# Altium schematic sheet suicide-switch-circuit-with-usb-battery-charger.SchDoc
size A4
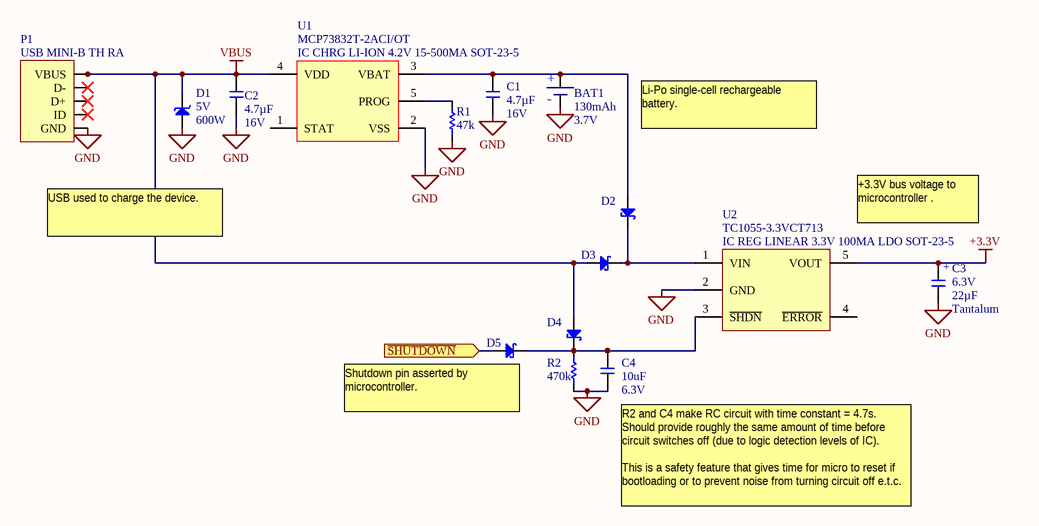
[diagram p0: suicide-switch-circuit-with-usb-battery-charger.SchDoc]

## Parts
BAT1  Capacity: 130mAh  Voltage: 3.7V  (hidden comment: BAT)
C1  Capacitance: 4.7µF  Voltage - Rated: 16V  [CAP-N-1608[0603]]  (hidden comment: EMK212BJ475KG-T)
C2  Capacitance: 4.7µF  Voltage - Rated: 16V  [CAP-N-1608[0603]]  (hidden comment: EMK212BJ475KG-T)
C3  Voltage - Rated: 6.3V  Capacitance: 22µF  Type: Tantalum  [CAP TAN 3216[1206]]  (hidden comment: TAJA226K006RNJ)
C4  Capacitance: 10uF  Voltage - Rated: 6.3V  [CAP-N-3216[1206]]  (hidden comment: GRM31CR60J107ME39L)
D1  Voltage - Reverse Standoff (Typ): 5V  Power (Watts): 600W  [SMA (DO-214AC)]  (hidden comment: SMA6J5.0A-TR)
D2  CDBU0130L  [DIODE-N-1608[0603]]  (value not drawn)
D3  CDBU0130L  [DIODE-N-1608[0603]]  (value not drawn)
D4  CDBU0130L  [DIODE-N-1608[0603]]  (value not drawn)
D5  CDBU0130L  [DIODE-N-1608[0603]]  (value not drawn)
P1  USB MINI-B TH RA  [USB MINI-B TH RA]
R1  Resistance (Ohms): 47k  [RES-N-1608[0603]]  (hidden comment: RC0603FR-0747KL)
R2  Resistance (Ohms): 470k  [RES-N-1608[0603]]  (hidden comment: RC0603FR-0747KL)
U1  (no value)  [SOT-23-5]
U2  TC1055-3.3VCT713  [SOT-23-5]

## Ports
~{SHUTDOWN} (in)

## Nets
+3.3V: C3.1 U2.5(VOUT)
GND: BAT1.2(-) C1.1 C2.1 C3.2 C4.1 D1.1(A) P1.5(GND) R1.1 R2.1 U1.2(VSS) U2.2(GND)
VBUS: C2.2 D1.2(K) D3.1(A) D4.1(A) P1.1(VBUS) U1.4(VDD)
~{SHUTDOWN}: D5.1(A) ; port ~{SHUTDOWN}
NetBAT1_1: BAT1.1(+) C1.2 D2.1(A) U1.3(VBAT)
NetC4_2: C4.2 D4.2(K) D5.2(K) R2.2 U2.3(~{SHDN})
NetD2_2: D2.2(K) D3.2(K) U2.1(VIN)
NetR1_2: R1.2 U1.5(PROG)

Not connected (* = marked no-connect by the designer): P1 2(D-)* 3(D+)* 4(ID)*; U1 1(STAT); U2 4(~{ERROR})

## Notes on the sheet
- Li-Po single-cell rechargeable battery.
- USB used to charge the device.
- +3.3V bus voltage to microcontroller .
- (near D5) Shutdown pin asserted by microcontroller.
- R2 and C4 make RC circuit with time constant = 4.7s. Should provide roughly the same amount of time before circuit switches off (due to logic detection levels of IC).
  This is a safety feature that gives time for micro to reset if bootloading or to prevent noise from turning circuit off e.t.c.
- (in symbol TAJA226K006RNJ) +

## Library data of the parts
BAT1 = BATT: BATT LI-PO 1CELL
C1 C2 = EMK212BJ475KG-T: CAP CER 0603 4.7uF 16V X5R 10%; Manufacturer: Taiyo Yuden; Description: CAP CER 4.7UF 16V 10% X5R 0805; Supplier 1: Digi-Key; Manufacturer Part Number: EMK212BJ475KG-T; RoHS: RoHS Compliant; Category: Capacitors; Stock 1: 69489; Pricing 1: 1=0.24, 10=0.165, 50=0.1, 100=0.084, 250=0.068, 500=0.06, 1000=0.051 (USD); Tolerance: ±10%; Temperature Coefficient: X5R; Mounting Type: Surface Mount, MLCC; Operating Temperature: -55°C ~ 85°C; Applications: General Purpose; Ratings: -; Package / Case: 0805 (2012 Metric); Size / Dimension: 0.079" L x 0.049" W (2.00mm x 1.25mm); Height - Seated (Max): -; Thickness (Max): 0.053" (1.35mm); Lead Spacing: -; Features: -; Packaging: Cut Tape (CT); Lead Style: -; ComponentLink1URL: http://www.yuden.co.jp/productdata/catalog/en/mlcc01_e.pdf; ComponentLink1Description: http://www.yuden.co.jp/productdata/catalog/en/mlcc01_e.pdf; Supplier Part Number 1: 587-1294-1-ND
C3 = TAJA226K006RNJ: CAP TAN 22UF 6.3V 10% 1206; Manufacturer: AVX Corporation; Manufacturer Size Code: A; Description: CAP TANT 22UF 6.3V 10% 1206; ESR (Equivalent Series Resistance): 3.000 Ohm; Type: Molded; Supplier 1: Digi-Key; Manufacturer Part Number: TAJA226K006RNJ; RoHS: RoHS Compliant; Category: Capacitors; Stock 1: 1618284; Pricing 1: 1=0.33, 10=0.287, 100=0.1435, 250=0.1148, 500=0.10456, 1000=0.0943 (USD); Tolerance: ±10%; Operating Temperature: -55°C ~ 125°C; Mounting Type: Surface Mount; Package / Case: 1206 (3216 Metric); Size / Dimension: 0.126" L x 0.063" W (3.20mm x 1.60mm); Height - Seated (Max): 0.071" (1.80mm); Lead Spacing: -; Features: General Purpose; Packaging: Cut Tape (CT); Lifetime @ Temp.: -; ComponentLink1URL: http://www.avx.com/docs/Catalogs/taj.pdf; ComponentLink1Description: http://www.avx.com/docs/Catalogs/taj.pdf; Supplier Part Number 1: 478-3865-1-ND
C4 = GRM31CR60J107ME39L: CAP CER 1206 100uF 6.3V X5R 20%
D1 = SMA6J5.0A-TR: DIODE TVS 5.0V UNI 600W SMA; Manufacturer: STMicroelectronics; Description: TRANSIL 600W 5.0V UNIDIRECT SMA; Voltage - Breakdown: 6.4V; Polarization: Unidirectional; Supplier 1: Digi-Key; RoHS: RoHS Compliant; Category: Circuit Protection; Stock 1: 45547; Pricing 1: 1=0.54, 10=0.453, 25=0.3972, 100=0.3399, 250=0.2948, 500=0.2497, 1000=0.1925, 2500=0.176 (USD); Mounting Type: Surface Mount; Package / Case: DO-214AC, SMA; Supplier Device Package: SMA; Packaging: Cut Tape (CT); ComponentLink1URL: http://www.st.com/internet/com/TECHNICAL_RESOURCES/TECHNICAL_LITERATURE/DATASHEET/CD00152688.pdf; ComponentLink1Description: http://www.st.com/internet/com/TECHNICAL_RESOURCES/TECHNICAL_LITERATURE/DATASHEET/CD00152688.pdf; Supplier Part Number 1: 497-5938-1-ND; Manufacturer Part Number: SMA6J5.0A-TR
D2-D5 = CDBU0130L: DIODE SCHOTTKY 30V 100MA 0603; Manufacturer: Comchip Technology; Description: DIODE SCHOTTKY 100MA 30V 0603; Voltage - Forward (Vf) (Max) @ If: 350mV @ 10mA; Speed: Small Signal =< 200mA (Io), Any Speed; Current - Reverse Leakage @ Vr: 10µA @ 10V; Supplier 1: Digi-Key; RoHS: RoHS Compliant; Category: Discrete Semiconductor Products; Stock 1: 61718; Pricing 1: 1=0.45, 10=0.324, 25=0.2524, 100=0.1911, 250=0.13512, 500=0.10816, 1000=0.08295 (USD); Diode Type: Schottky; Reverse Recovery Time (trr): -; Capacitance @ Vr, F: -; Mounting Type: Surface Mount; Package / Case: 0603 (1608 Metric); Supplier Device Package: 0603 (1608 Metric); Packaging: Cut Tape (CT); ComponentLink1URL: http://www.comchiptech.com/cms/UserFiles/CDBU0130L-RevA791956.pdf; ComponentLink1Description: http://www.comchiptech.com/cms/UserFiles/CDBU0130L-RevA791956.pdf; Supplier Part Number 1: 641-1282-1-ND
P1 = USB MINI-B TH RA: Manufacturer: Molex Inc; Manufacturer Part Number: 0548190519; Connector Type: USB - mini B; Number of Contacts: 5; Gender: Receptacle; Specifications: USB 2.0 OTG; Supplier 1: Digi-Key; RoHS: RoHS Compliant; Category: Connectors, Interconnects; Stock 1: 6713; Pricing 1: 1=1.79, 10=1.49, 25=1.3796, 50=1.2418, 100=1.1038, 250=0.96584, 500=0.88304, 1000=0.80026, 2500=0.71747 (USD); Mounting Type: Through Hole, Right Angle, Horizontal; Features: Shielded; Packaging: Tray; Ingress Protection: -; ComponentLink1URL: http://www.molex.com/pdm_docs/sd/548190519_sd.pdf; ComponentLink1Description: http://www.molex.com/pdm_docs/sd/548190519_sd.pdf; Supplier Part Number 1: WM17115-ND; Description: USB MINI-B TH RA
R1 R2 = RC0603FR-0747KL: RES 0603 47.0K 1% 1/10W; Manufacturer: Yageo; Description: RES 47.0K OHM 1/10W 1% 0603 SMD; Power (Watts): 0.1W, 1/10W; Temperature Coefficient: ±100ppm/°C; Supplier 1: Digi-Key; Manufacturer Part Number: RC0603FR-0747KL; RoHS: RoHS Compliant; Category: Resistors; Stock 1: 687750; Pricing 1: 10=0.014, 100=0.0063, 500=0.00382, 1000=0.0027 (USD); Composition: Thick Film; Features: -; Tolerance: ±1%; Package / Case: 0603 (1608 Metric); Size / Dimension: 0.063" L x 0.031" W (1.60mm x 0.80mm); Height: 0.022" (0.55mm); Number of Terminations: 2; Packaging: Cut Tape (CT); ComponentLink1URL: http://www.yageo.com/documents/recent/PYu-RC0603_51_RoHS_L_4.pdf; ComponentLink1Description: http://www.yageo.com/documents/recent/PYu-RC0603_51_RoHS_L_4.pdf; Supplier Part Number 1: 311-47.0KHRCT-ND
U1 = MCP73832T-2ACI/OT: IC CHRG LI-ION 4.2V 15-500MA SOT-23-5; Manufacturer: Microchip Technology; Function: Charge Management; Battery Chemistry: Lithium-Ion (Li-Ion), Lithium-Polymer (Li-Pol); Voltage - Supply: 3.75 V ~ 6 V; Supplier 1: Digi-Key; RoHS: RoHS Compliant; Category: Integrated Circuits (ICs); Stock 1: 7112; Pricing 1: 1=0.68, 10=0.56, 25=0.47, 100=0.42 (USD); Operating Temperature: -40°C ~ 85°C; Mounting Type: Surface Mount; Package / Case: SC-74A, SOT-753; Supplier Device Package: SOT-23-5; Packaging: Cut Tape (CT); ComponentLink1URL: http://ww1.microchip.com/downloads/en/DeviceDoc/21984E.pdf; ComponentLink1Description: http://ww1.microchip.com/downloads/en/DeviceDoc/21984E.pdf; Supplier Part Number 1: MCP73832T-2ACI/OTCT-ND; Manufacturer Part Number: MCP73832T-2ACI/OT
U2 = TC1055-3.3VCT713: IC REG LINEAR 3.3V 100MA LDO SOT-23-5; Manufacturer: Microchip Technology; Regulator Topology: Positive Fixed; Voltage - Input: Up to 6V; Voltage - Dropout (Typical): 0.18V @ 100mA; Number of Regulators: 1; Current - Output: 100mA (Min); Supplier 1: Digi-Key; RoHS: RoHS Compliant; Category: Integrated Circuits (ICs); Stock 1: 14924; Pricing 1: 1=0.43, 10=0.36, 25=0.3, 100=0.27 (USD); Voltage - Output: 3.3V; Current - Limit (Min): -; Operating Temperature: -40°C ~ 125°C; Mounting Type: Surface Mount; Package / Case: SC-74A, SOT-753; Supplier Device Package: SOT-23-5; Packaging: Cut Tape (CT); ComponentLink1URL: http://ww1.microchip.com/downloads/en/DeviceDoc/21350d.pdf; ComponentLink1Description: http://ww1.microchip.com/downloads/en/DeviceDoc/21350d.pdf; Supplier Part Number 1: TC10553.3VCT713CT-ND; Manufacturer Part Number: TC1055-3.3VCT713